# EAGLE design Main (EAGLE 6.2)
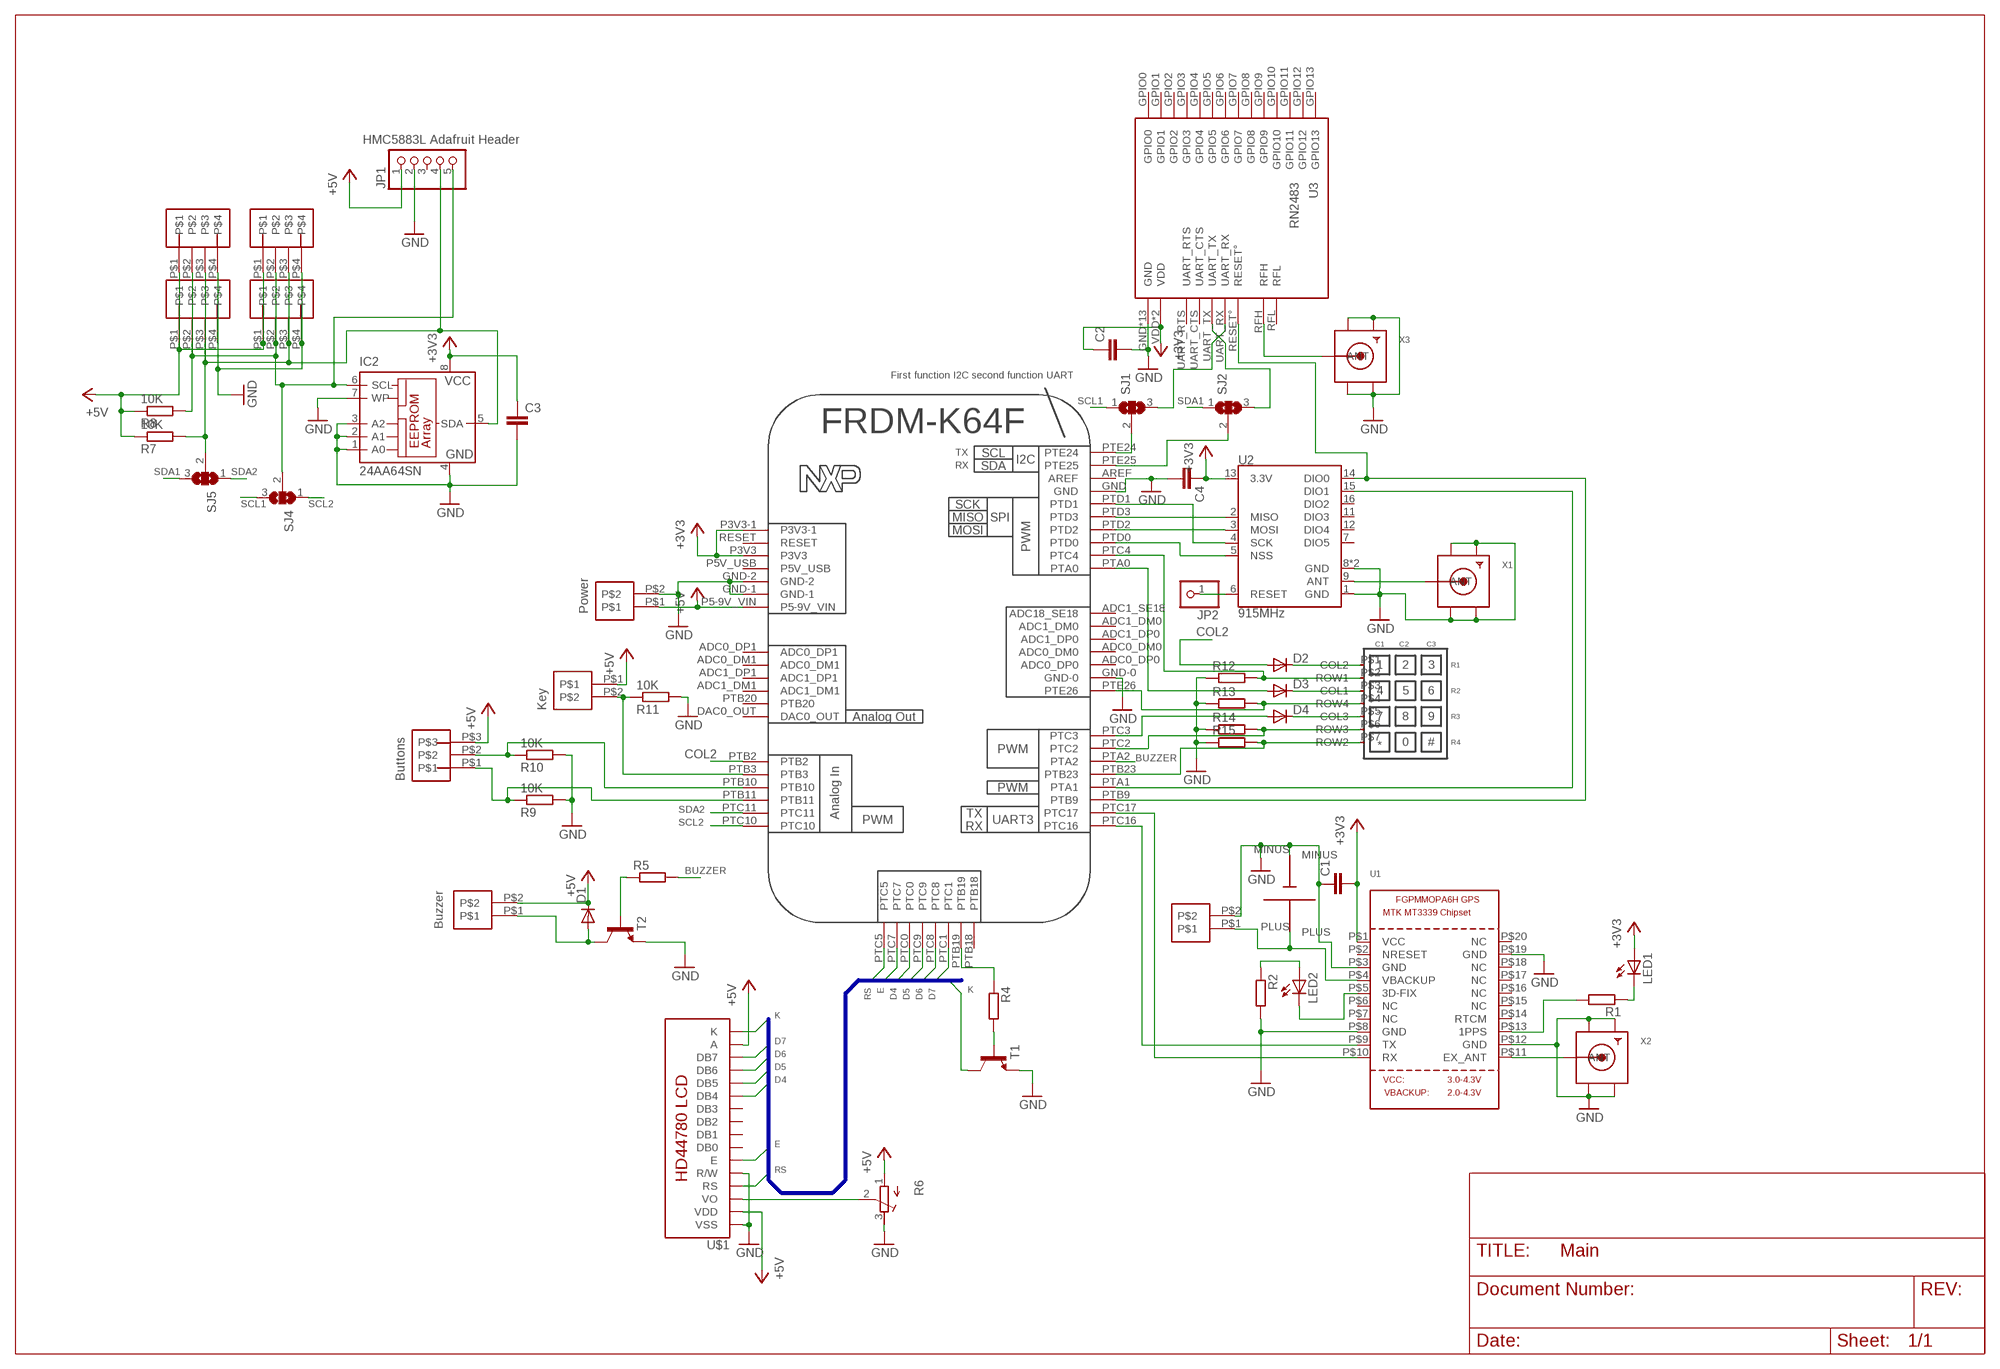
[diagram p0: schematic, sheet 1]

## Parts
C1  C-EUC0603  [C0603]
C2  C-EUC0603  [C0603]
C3  C-EUC0603  [C0603]
C4  C-EUC0603  [C0603]
D1  DIODE-MINIMELF  [MINIMELF]
D2  DIODE-MINIMELF  [MINIMELF]
D3  DIODE-MINIMELF  [MINIMELF]
D4  DIODE-MINIMELF  [MINIMELF]
IC2  24AA64SN  [SO-08]
JP1  PINHD-1X5  [1X05]
JP2  PINHD-1X1  [1X01]
LED1  LEDCHIPLED_1206  [CHIPLED_1206]
LED2  LEDCHIPLED_1206  [CHIPLED_1206]
R1  R-EU_R0603  [R0603]
R2  R-EU_R0603  [R0603]
R4  R-EU_R0603  [R0603]
R5  R-EU_R0603  [R0603]
R6  R-TRIMM3103  [RTRIM3103]
R7  10K  R-EU_R0603  [R0603]
R8  10K  R-EU_R0603  [R0603]
R9  10K  R-EU_R0603  [R0603]
R10  10K  R-EU_R0603  [R0603]
R11  10K  R-EU_R0603  [R0603]
R12  R-EU_R0603  [R0603]
R13  R-EU_R0603  [R0603]
R14  R-EU_R0603  [R0603]
R15  R-EU_R0603  [R0603]
SJ1  SJ2W  [SJ_2]
SJ2  SJ2W  [SJ_2]
SJ4  SJ2W  [SJ_2]
SJ5  SJ2W  [SJ_2]
T1  MMBT3904LT1-NPN-SOT23-BEC  [SOT23-BEC]
T2  MMBT3904LT1-NPN-SOT23-BEC  [SOT23-BEC]
U1  GPS_FGPMMOPA6H  [FGPMMOPA6H]
U2  915MHz  RFM69HCW-915  [RFM69HCW-XXXS2]
U3  RN2483  [RN2483]
U$1  LCD-HD447804-HOLES20X4-4HOLES  [LCD-20X4-4HOLES]
U$2  FRDM  [FRDM]
U$3  4_PIN_JST-XH  [4_PIN_JST-XH]
U$4  2_PIN_JST-XH  [2_PIN_JST-XH]
U$5  4_PIN_JST-XH  [4_PIN_JST-XH]
U$6  3_PIN_JST-XH  [3_PIN_JST-XH]
U$8  2_PIN_JST-XH  [2_PIN_JST-XH]
U$9  2_PIN_JST-XH  [2_PIN_JST-XH]
U$10  KEYPAD  [KEYPAD]
U$11  4_PIN_JST-XH  [4_PIN_JST-XH]
U$12  4_PIN_JST-XH  [4_PIN_JST-XH]
U$13  2_PIN_JST-XH  [2_PIN_JST-XH]
U$14  BATTERY-SMD  [BATTERY-SMD]
X1  SMACONNECTOR_EDGE  [SMA_EDGELAUNCH]
X2  SMACONNECTOR_EDGE  [SMA_EDGELAUNCH]
X3  SMACONNECTOR_EDGE  [SMA_EDGELAUNCH]

## Nets
+3V3: C1.2 C2.1 C3.1 C4.1 IC2.8(VCC) LED1.A U1.P$1(VCC) U2.13(3.3V) U3.VDD U3.VDD2(VDD) U$2.P3V3 U$2.P3V3-1
+5V: D1.C JP1.1 R6.1(E) R7.1 R8.1 U$1.P$2(VDD) U$1.P$15(A) U$2.P5-9V_VIN U$3.P$1 U$4.P$2 U$5.P$1 U$6.P$3 U$8.P$1 U$9.P$1 U$11.P$1 U$12.P$1
BUZZER: R5.2 U$2.PTA2
COL2: D2.A U$2.PTB2
D4: U$1.P$11(DB4) U$2.PTC0
D5: U$1.P$12(DB5) U$2.PTC9
D6: U$1.P$13(DB6) U$2.PTC8
D7: U$1.P$14(DB7) U$2.PTC1
E: U$1.P$6(E) U$2.PTC7
GND: C1.1 C2.2 C3.2 C4.2 IC2.1(A0) IC2.2(A1) IC2.3(A2) IC2.4(GND) IC2.7(WP) JP1.2 R2.2 R6.3(A) R9.2 R10.2 R11.2 R12.1 R13.1 R14.1 R15.1 T1.E T2.E U1.P$3(GND) U1.P$8(GND) U1.P$12(GND) U1.P$19(GND) U2.1(GND) U2.8(GND) U2.10(GND) U3.GND U3.GND1(GND) U3.GND2(GND) U3.GND3(GND) U3.GND4(GND) U3.GND5(GND) U3.GND6(GND) U3.GND7(GND) U3.GND8(GND) U3.GND9(GND) U3.GND10(GND) U3.GND11(GND) U3.GND12(GND) U$1.P$1(VSS) U$1.P$5(R/W) U$2.GND U$2.GND-0 U$2.GND-1 U$2.GND-2 U$3.P$4 U$5.P$4 U$9.P$2 U$11.P$4 U$12.P$4 U$13.P$2 U$14.MINUS X1.GND@1(GND4) X1.GND@2(GND3) X1.GND@3(GND2) X1.GND@4(GND1) X2.GND@1(GND4) X2.GND@2(GND3) X2.GND@3(GND2) X2.GND@4(GND1) X3.GND@1(GND4) X3.GND@2(GND3) X3.GND@3(GND2) X3.GND@4(GND1)
K: T1.C U$1.P$16(K)
N$1: U2.2(MISO) U$2.PTD3
N$2: U2.3(MOSI) U$2.PTD2
N$3: U2.4(SCK) U$2.PTD1
N$4: U2.5(NSS) U$2.PTD0
N$5: U2.9(ANT) X1.P(ANT)
N$6: U1.P$9(TX) U$2.PTC16
N$7: U1.P$11(EX_ANT) X2.P(ANT)
N$8: D4.C U$10.P$5(COL3)
N$9: U1.P$10(RX) U$2.PTC17
N$10: LED1.C R1.1
N$11: LED2.A R2.1
N$12: LED2.C U1.P$5(3D-FIX)
N$13: R1.2 U1.P$13(1PPS)
N$14: SJ1.2 U$2.PTE24
N$15: R11.1 U$2.PTB3 U$8.P$2
N$16: U2.14(DIO0) U3.RESET° U$2.PTB9
N$17: U2.15(DIO1) U$2.PTA1
N$18: D3.C U$10.P$3(COL1)
N$19: R4.1 U$2.PTB19
N$20: R4.2 T1.B
N$21: D1.A T2.C U$4.P$1
N$22: R5.1 T2.B
N$23: D3.A U$2.PTA0
N$24: SJ1.3 U3.UART_RX
N$25: IC2.5(SDA) JP1.4 R7.2 SJ5.2 U$3.P$3 U$5.P$3 U$11.P$3 U$12.P$3
N$26: U1.P$4(VBACKUP) U$13.P$1 U$14.PLUS
N$27: D2.C U$10.P$1(COL2)
N$28: R10.1 U$2.PTB10 U$6.P$2
N$29: R9.1 U$2.PTB11 U$6.P$1
N$30: R15.2 U$2.PTB23 U$10.P$7(ROW2)
N$31: R14.2 U$2.PTC2 U$10.P$6(ROW3)
N$32: R13.2 U$2.PTE26 U$10.P$4(ROW4)
N$33: R12.2 U$2.PTC4 U$10.P$2(ROW1)
N$34: D4.A U$2.PTC3
N$35: JP2.1 U2.6(RESET)
N$36: SJ2.2 U$2.PTE25
N$37: SJ2.3 U3.UART_TX
N$38: IC2.6(SCL) JP1.5 R8.2 SJ4.2 U$3.P$2 U$5.P$2 U$11.P$2 U$12.P$2
N$39: U3.RFH X3.P(ANT)
N$41: R6.2(S) U$1.P$3(VO)
RS: U$1.P$4(RS) U$2.PTC5
SCL1: SJ1.1 SJ4.3
SCL2: SJ4.1 U$2.PTC10
SDA1: SJ2.1 SJ5.3
SDA2: SJ5.1 U$2.PTC11
Unconnected: JP1.3 U1.P$2(NRESET) U1.P$6(NC) U1.P$7(NC) U1.P$14(RTCM) U1.P$15(NC) U1.P$16(NC) U1.P$17(NC) U1.P$18(NC) U1.P$20(NC) U2.7(DIO5) U2.11(DIO3) U2.12(DIO4) U2.16(DIO2) U3.GPIO0 U3.GPIO1 U3.GPIO2 U3.GPIO3 U3.GPIO4 U3.GPIO5 U3.GPIO6 U3.GPIO7 U3.GPIO8 U3.GPIO9 U3.GPIO10 U3.GPIO11 U3.GPIO12 U3.GPIO13 U3.RFL U3.UART_CTS U3.UART_RTS U$1.P$7(DB0) U$1.P$8(DB1) U$1.P$9(DB2) U$1.P$10(DB3) U$2.ADC0_DM0 U$2.ADC0_DM1 U$2.ADC0_DP0 U$2.ADC0_DP1 U$2.ADC1_DM0 U$2.ADC1_DM1 U$2.ADC1_DP0 U$2.ADC1_DP1 U$2.ADC1_SE18(ADC18_SE18) U$2.AREF U$2.DAC0_OUT U$2.P5V_USB U$2.PTB18 U$2.PTB20 U$2.RESET

## Buses
D[4..7],E,RS,VSS,VDD,VO,K,A,RW

## Notes on the sheet
- HMC5883L Adafruit Header
- First function I2C second function UART
- TX
- RX
- Power
- Key
- Buttons
- Buzzer

## Library data of the parts
C1-C4 = rcl:C-EU: CAPACITOR, European symbol
D1-D4 = diode:DIODE-: DIODE
IC2 = microchip:24*: Serial EEPROM I2C; MF: MICROCHIP; MPN: 24AA64-I/SN; OC_FARNELL: 1331304; OC_NEWARK: 85C2288
JP1 = pinhead:PINHD-1X5: PIN HEADER
JP2 = pinhead:PINHD-1X1: PIN HEADER
LED1 LED2 = adafruit:LED: LED OSRAM: - CHIPLED LG R971, LG N971, LY N971, LG Q971, LY Q971, LO R971, LY R971 LH N974, LH R974 LS Q976, LO Q976, LY Q976 LO Q996 - Hyper CHIPLED LW Q18S LB Q993, LB Q99A, LB R99A - SideLED LS A670, LO A670, LY A670, LG A670, LP A670 LB A673, LV A673, LT A673, LW A673 LH A674 LY A675 LS A676, LA A676, LO A676, LY A676, LW A676 LS A679, LY A679, LG A679 - Hyper Micro SIDELED® LS Y876, LA Y876, LO Y876, LY Y876 LT Y87S - SmartLED LW L88C, LW L88S LB L89C, LB L89S, LG L890 LS L89K, LO L89K, LY L89K LS L896, LA L896, LO L896, LY L896 - TOPLED LS T670, LO T670, LY T670, LG T670, LP T670 LSG T670, LSP T670, LSY T670, LOP T670, LYG T670 LG T671, LOG T671, LSG T671 LB T673, LV T673, LT T673, LW T673 LH T674 LS T676, LA T676, LO T676, LY T676, LB T676, LH T676, LSB T676, LW T676 LB T67C, LV T67C, LT T67C, LS T67K, LO T67K, LY T67K, LW E67C LS E67B, LA E67B, LO E67B, LY E67B, LB E67C, LV E67C, LT E67C LW T67C LS T679, LY T679, LG T679 LS T770, LO T770, LY T770, LG T770, LP T770 LB T773, LV T773, LT T773, LW T773 LH T774 LS E675, LA E675, LY E675, LS T675 LS T776, LA T776, LO T776, LY T776, LB T776 LHGB T686 LT T68C, LB T68C - Hyper Mini TOPLED® LB M676 - Mini TOPLED Santana® LG M470 LS M47K, LO M47K, LY M47K Source: http://www.osram.convergy.de/
R1 R2 R4 R5 R7-R15 = rcl:R-EU_: RESISTOR, European symbol
R6 = resistor:R-TRIMM: Trimm resistor
SJ1 SJ2 SJ4 SJ5 = jumper:SJ2W: SMD solder JUMPER
T1 T2 = transistor:*-NPN-: NPN Transistror BF959 corrected 2008.03.06
U1 = adafruit:GPS_FGPMMOPA6H: GPS Module - MTK MT3339 Chipset, -165dBm sensitivity, 22 channels, 10Hz, auto-select external antenna options
U2 = SparkFun-RF:RFM69H: Hope RF RFM69H ISM Transceiver Module The RFM69H is a transceiver module capable of operation over a wide frequency range, including the 315,433,868 and 915MHz license-free ISM (Industry Scientific and Medical) frequency bands. All major RF communication parameters are programmable and most of them can be dynamically set. The RFM69H offers the unique advantage of programmable narrow-band and wide- band communication modes. The RFM69H is optimized for low power consumption while offering high RF output power and channelized operation.Compliance ETSI and FCC regulations. Datasheet <http://www.hoperf.cn/upload/docs/RF/SX/RFM69H_DataSheet_v1.3.pdf> SparkFun Products RFM69HCW Wireless Transceiver - 915MHz <https://www.sparkfun.com/products/13909> (COM-13909) RFM69HCW Wireless Transceiver - 434MHz <https://www.sparkfun.com/products/13910> (COM-13910) SparkFun RFM69 Breakout (915MHz) <https://www.sparkfun.com/products/12775> (WRL-12775) SparkFun RFM69 Breakout (434MHz) <https://www.sparkfun.com/products/12823> (WRL-12823); PROD_ID: IC-11997
U3 = tobias:RN2483: RN2483 Microchip Low-Power Lora Transceiver Module NOT TESTED There are testpads on the bottom of the device. The mask is supposed to cover that, but I have not tested it in practice yet. Info: http://www.microchip.com/wwwproducts/Devices.aspx?product=RN2483 Datasheet: http://ww1.microchip.com/downloads/en/DeviceDoc/50002346B.pdf Adapted from: https://github.com/Octanis1/Octanis1-Electronics/blob/ae493cac28c100e20856abe563dfe8824e9cc4bd/lib/Octanis1.lbr
U$1 = HD44780LCD:LCD-HD44780
U$2 = Projectwerk2:FRDM: This is the symbol and PCB symbol for the FRDM-K64F board. Please not that the PCB symbol is a mirrored plug in type. So tha FRDM board plug in it.
U$3 U$5 U$11 U$12 = JST-XH_HEADERS:4_PIN_JST-XH
U$4 U$8 U$9 U$13 = JST-XH_HEADERS:2_PIN_JST-XH
U$6 = JST-XH_HEADERS:3_PIN_JST-XH
U$10 = adafruit:KEYPAD
U$14 = Projectwerk2:BATTERY-SMD
X1-X3 = adafruit:SMACONNECTOR: SMA Connector 90° DIP SMA Connector, 50 Ohm (4UConnector: 07259)

## Board
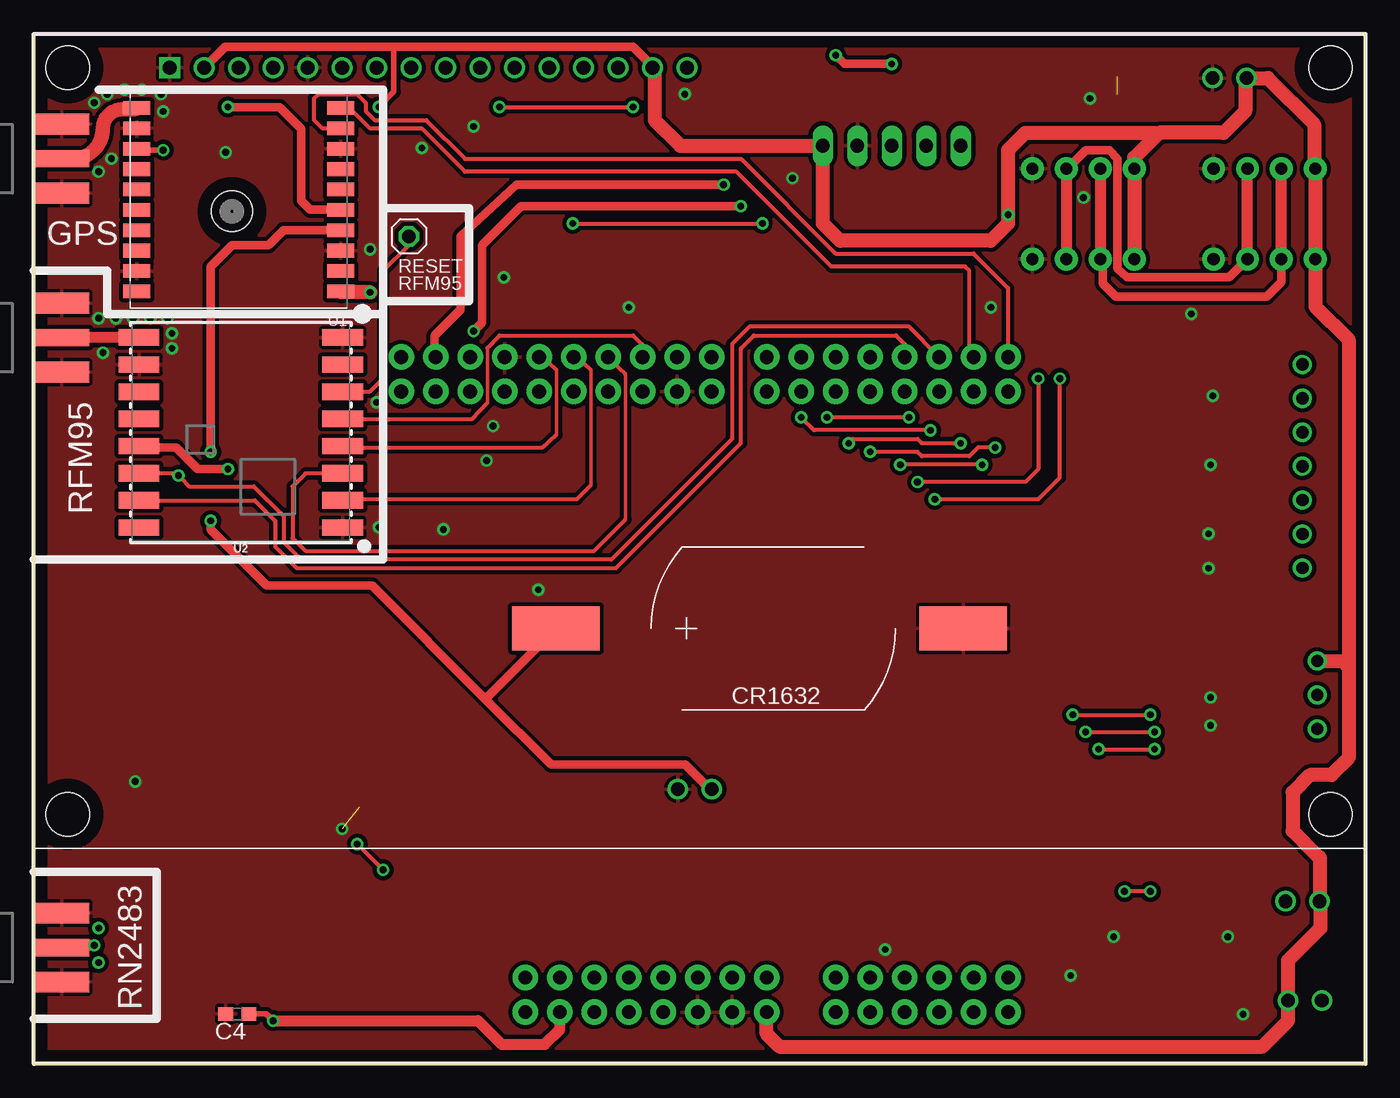
[diagram p1: board, top side]
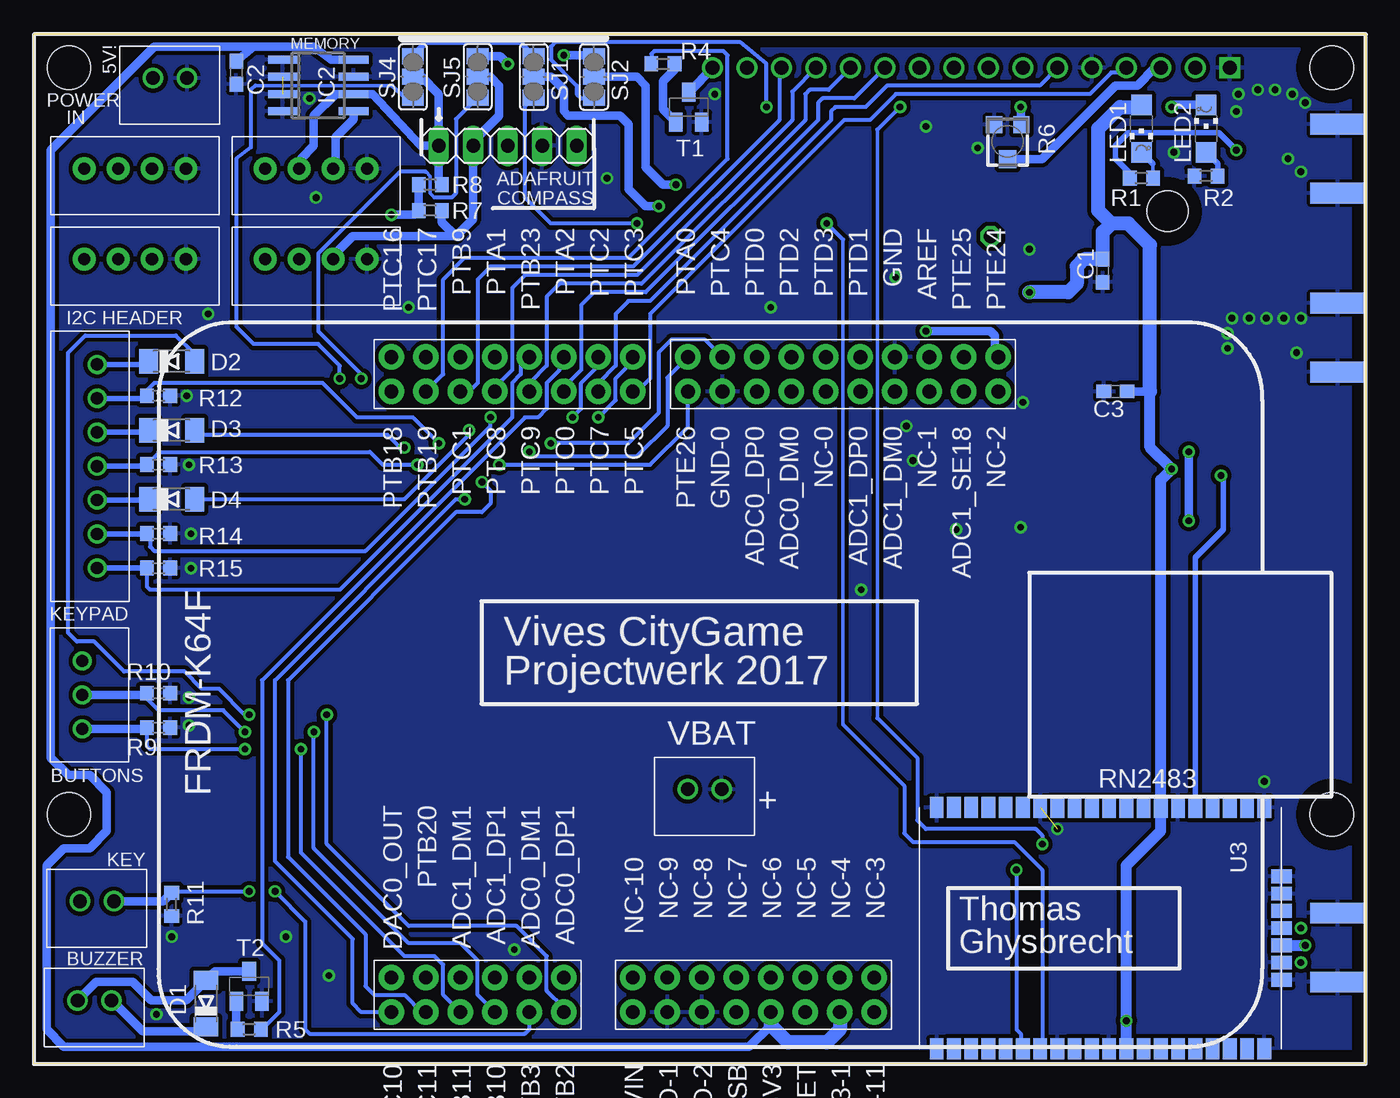
[diagram p2: board, bottom side, seen from below]

Size 98.09 x 75.87 mm. Coordinates in mm from the lower left corner, seen from the top.
Outline: 0,0 98.09,0 98.09,75.87 0,75.87 0,0
Copper layers (1*16): Top 0.035mm / dielectric 1.5mm / Bottom 0.035mm
Design rules: minimum track width 10mil, minimum drill 24mil, track to track 8mil, track to pad 8mil, pad to pad 8mil, via to via 8mil, smd to smd 8mil, copper to edge 40mil, drill to drill 8mil, minimum pad ring 10mil, minimum via ring 8mil, stop-mask expansion 4mil, vias tented up to drill 0mil, thermal gap 10mil

### Footprints (pad centres in the part's own frame; a part is rotated, then mirrored left to right if it is on the bottom)
C0603 = smd 1.1 x 1: 1 -0.85,0; 2 0.85,0
MINIMELF = smd 1.4 x 1.8: A 1.7,0; C -1.7,0
SO-08 = smd 0.6 x 2.2: 1 -1.905,-2.6; 2 -0.635,-2.6; 3 0.635,-2.6; 4 1.905,-2.6; 5 1.905,2.6; 6 0.635,2.6; 7 -0.635,2.6; 8 -1.905,2.6
1X05 = drill 1.016 long: 1 -5.08,0; 2 -2.54,0; 3 0,0; 4 2.54,0; 5 5.08,0
1X01 = drill 1.016 octagon: 1 0,0
CHIPLED_1206 = smd 1.5 x 1.5: A 0,-1.75; C 0,1.75
R0603 = smd 1 x 1.1: 1 -0.85,0; 2 0.85,0
RTRIM3103 = smd 1.2 x 1.25: 1 -1,-1.225; 3 1,-1.225 | smd 1.3 x 1.3: 2 0,1.3
SJ_2 = smd 1.168 x 1.6: 1 -1.524,0; 2 0,0; 3 1.524,0
SOT23-BEC = smd 1 x 1.4: B -0.95,-1.1; C 0,1.1; E 0.95,-1.1
FGPMMOPA6H = smd 2 x 1: P$1 -7.5,6.75; P$2 -7.5,5.25; P$3 -7.5,3.75; P$4 -7.5,2.25; P$5 -7.5,0.75; P$6 -7.5,-0.75; P$7 -7.5,-2.25; P$8 -7.5,-3.75; P$9 -7.5,-5.25; P$10 -7.5,-6.75; P$11 7.5,-6.75; P$12 7.5,-5.25; P$13 7.5,-3.75; P$14 7.5,-2.25; P$15 7.5,-0.75; P$16 7.5,0.75; P$17 7.5,2.25; P$18 7.5,3.75; P$19 7.5,5.25; P$20 7.5,6.75 | hole 3: 0.5,0.85
RFM69HCW-XXXS2 = smd 3 x 1.2: 1 -7.5,7; 2 -7.5,5; 3 -7.5,3; 4 -7.5,1; 5 -7.5,-1; 6 -7.5,-3; 7 -7.5,-5; 8 -7.5,-7; 9 7.5,-7; 10 7.5,-5; 11 7.5,-3; 12 7.5,-1; 13 7.5,1; 14 7.5,3; 15 7.5,5; 16 7.5,7
RN2483 = smd 1.524 x 1.016: GND 17.78,1.27; GND1 17.78,10.16; GND2 17.78,13.97; GND3 17.78,25.4; GND9 0,25.4; GND10 0,19.05; GND11 0,8.89; GND12 0,1.27; GPIO0 0,16.51; GPIO1 0,15.24; GPIO2 0,13.97; GPIO3 0,12.7; GPIO4 0,11.43; GPIO5 0,10.16; GPIO6 0,6.35; GPIO7 0,5.08; GPIO8 0,3.81; GPIO9 0,2.54; GPIO10 17.78,17.78; GPIO11 17.78,16.51; GPIO12 17.78,12.7; GPIO13 17.78,11.43; P$1 0,21.59; P$2 0,22.86; P$3 0,24.13; P$4 17.78,24.13; P$5 17.78,22.86; P$6 17.78,21.59; P$7 17.78,20.32; P$8 17.78,19.05; P$9 17.78,6.35; P$10 17.78,5.08; P$11 0,7.62; RESET° 0,20.32; UART_CTS 17.78,3.81; UART_RTS 17.78,2.54; UART_RX 17.78,8.89; UART_TX 17.78,7.62; VDD 17.78,15.24; VDD2 0,17.78 | smd 1.016 x 1.524: GND4 12.7,26.67; GND5 11.43,26.67; GND6 8.89,26.67; GND7 6.35,26.67; GND8 5.08,26.67; RFH 10.16,26.67; RFL 7.62,26.67
LCD-20X4-4HOLES = drill 1.016 square: P$1 10,57.5 | drill 1.016: P$2 12.54,57.5; P$3 15.08,57.5; P$4 17.62,57.5; P$5 20.16,57.5; P$6 22.7,57.5; P$7 25.24,57.5; P$8 27.78,57.5; P$9 30.32,57.5; P$10 32.86,57.5; P$11 35.4,57.5; P$12 37.94,57.5; P$13 40.48,57.5; P$14 43.02,57.5; P$15 45.56,57.5; P$16 48.1,57.5 | hole 3.2: 2.5,2.5; 2.5,57.5; 95.5,57.5; 95.5,2.5
FRDM = drill 1.016 pad 1.88: ADC0_DM0 -21.59,-2.286; ADC0_DM1 21.59,-21.59; ADC0_DP0 -21.59,-4.826; ADC0_DP1 21.59,-19.05; ADC1_DM0 -21.59,5.334; ADC1_DM1 21.59,-26.67; ADC1_DP0 -21.59,2.794; ADC1_DP1 21.59,-24.13; ADC1_SE18 -21.59,10.414; AREF -24.13,7.874; DAC0_OUT 21.59,-31.75; GND -24.13,5.334; GND-0 -21.59,-7.366; GND-1 24.13,-11.43; GND-2 24.13,-8.89; NC-0 -21.59,0.254; NC-1 -21.59,7.874; NC-2 -21.59,12.954; NC-3 21.59,3.81; NC-4 21.59,1.27; NC-5 21.59,-1.27; NC-6 21.59,-3.81; NC-7 21.59,-6.35; NC-8 21.59,-8.89; NC-9 21.59,-11.43; NC-10 21.59,-13.97; NC-11 24.13,3.81; P3V3 24.13,-3.81; P3V3-1 24.13,1.27; P5-9V_VIN 24.13,-13.97; P5V_USB 24.13,-6.35; PTA0 -24.13,-9.906; PTA1 -24.13,-24.13; PTA2 -24.13,-19.05; PTB2 24.13,-19.05; PTB3 24.13,-21.59; PTB9 -24.13,-26.67; PTB10 24.13,-24.13; PTB11 24.13,-26.67; PTB18 -21.59,-31.75; PTB19 -21.59,-29.21; PTB20 21.59,-29.21; PTB23 -24.13,-21.59; PTC0 -21.59,-19.05; PTC1 -21.59,-26.67; PTC2 -24.13,-16.51; PTC3 -24.13,-13.97; PTC4 -24.13,-7.366; PTC5 -21.59,-13.97; PTC7 -21.59,-16.51; PTC8 -21.59,-24.13; PTC9 -21.59,-21.59; PTC10 24.13,-31.75; PTC11 24.13,-29.21; PTC16 -24.13,-31.75; PTC17 -24.13,-29.21; PTD0 -24.13,-4.826; PTD1 -24.13,2.794; PTD2 -24.13,-2.286; PTD3 -24.13,0.254; PTE24 -24.13,12.954; PTE25 -24.13,10.414; PTE26 -21.59,-9.906; RESET 24.13,-1.27
4_PIN_JST-XH = drill 0.9 pad 1.676: P$1 2.45,3.4; P$2 4.95,3.4; P$3 7.45,3.4; P$4 9.95,3.4
2_PIN_JST-XH = drill 1: P$1 -1.36,0.86; P$2 1.14,0.86
3_PIN_JST-XH = drill 0.9: P$1 2.45,3.4; P$2 4.95,3.4; P$3 7.45,3.4
KEYPAD = drill 0.9: P$1 2.45,3.4; P$2 4.95,3.4; P$3 7.45,3.4; P$4 9.95,3.4; P$5 12.45,3.4; P$6 14.95,3.4; P$7 17.45,3.4
BATTERY-SMD = smd 6.452 x 3.251: MINUS -14,0; PLUS 16,0
SMA_EDGELAUNCH = smd 4.064 x 1.524: GND@1 2.032,-2.54; GND@2 2.032,2.54 | smd 4.064 x 1.524 bottom: GND@3 2.032,2.54; GND@4 2.032,-2.54 | smd 4.064 x 1.27: P 2.032,0

### Placement (x,y rotation side)
C1  19.37,58.42 90 bottom
C2  83.19,73.03 270 bottom
C3  18.41,49.53 180 bottom
C4  14.99,3.68 180 top
D1  85.41,4.45 90 bottom
D2  87.95,51.75 0 bottom
D3  87.95,46.67 0 bottom
D4  87.95,41.59 0 bottom
IC2  77.15,72.07 270 bottom
JP1  63.18,67.63 180 bottom
JP2  27.62,60.96 0 top
LED1  16.51,68.9 180 bottom
LED2  11.75,68.9 0 bottom
R1  16.51,65.25 180 bottom
R2  11.75,65.41 180 bottom
R4  51.75,73.66 0 bottom
R5  82.23,2.54 0 bottom
R6  26.35,67.94 180 bottom
R7  68.9,62.87 0 bottom
R8  68.9,64.77 0 bottom
R9  88.9,24.77 0 bottom
R10  88.9,27.3 0 bottom
R11  87.95,11.75 270 bottom
R12  88.9,49.21 180 bottom
R13  88.9,44.13 180 bottom
R14  88.9,39.05 180 bottom
R15  88.9,36.51 180 bottom
SJ1  61.28,72.71 270 bottom
SJ2  56.83,72.71 270 bottom
SJ4  70.17,72.71 90 bottom
SJ5  65.41,72.71 90 bottom
T1  49.85,70.48 0 bottom
T2  82.23,5.71 0 bottom
U1  15.08,63.66 180 top
U2  15.24,46.51 180 top
U3  32.86,18.89 270 bottom
U$1  0,15.88 0 top
U$2  40.01,27.94 270 bottom
U$3  96.84,55.88 0 bottom
U$4  93.5,3.81 0 bottom
U$5  96.84,62.55 0 bottom
U$6  91.12,22.23 90 bottom
U$8  93.34,11.11 0 bottom
U$9  87.95,71.75 0 bottom
U$10  96.84,53.98 270 bottom
U$11  83.5,62.55 0 bottom
U$12  83.5,55.88 0 bottom
U$13  48.58,19.37 0 bottom
U$14  54.45,32.07 180 top
X1  0,53.5 0 top
X2  0,66.67 0 top
X3  0,8.57 0 top

### Tracks (layer width: path | path; a pad name or v marks a point on that pad's centre or on a via)
+3V3  (via drill 0.5)
  Top 0.406: C4.1 17.11,3.68 v17.62,3.18
  Top 0.61: U2.13 7.85,45.4 10.48,45.4 12.06,43.81 v14.29,43.81
  Top 0.813: v17.62,3.18 32.7,3.18 34.45,1.43 37.62,1.43 38.73,2.54 U$2.P3V3-1
  Top 1.016: v24.77,56.83 22.66,56.83 U1.P$1
  Bottom 0.406: 17.43,12.89 17.62,12.7
  Bottom 0.61: IC2.8 76.2,73.98 77.47,74.93 81.92,74.93 | 81.92,74.93 89.22,74.93 96.84,67.31 96.84,22.54 95.57,21.27 93.98,21.27 92.71,20 92.71,17.14 93.98,15.88 95.89,15.88 97.16,14.61 97.16,2.54 95.89,1.27 45.4,1.27 43.81,2.86 | C2.1 81.92,74.93 | C3.1 15.88,49.53
  Bottom 0.813: U3.VDD v17.62,3.18 17.62,12.7 17.62,14.61 15.08,17.14 U3.VDD2 15.08,43.02 v14.29,43.81 15.88,45.4 15.88,49.53
  Bottom 1.016: U$2.P3V3 43.81,2.86 42.55,1.59 39.69,1.59 38.73,2.54 U$2.P3V3-1 | 15.88,49.53 15.88,60.33 17.46,61.91 18.73,61.91 | 18.73,61.91 19.68,62.87 19.68,68.9 18.1,70.48 16.67,70.48 LED1.A | 18.73,61.91 19.37,61.28 C1.2 20.74,59.27 21.27,58.74 21.27,57.47 21.91,56.83 v24.77,56.83
+5V  (via drill 0.5)
  Top 0.406: v25.4,70.48 26.51,71.6 26.51,74.93
  Top 0.61: U$1.P$2 14.1,74.93 26.51,74.93 44.13,74.93 45.56,73.5
  Top 1.016: 96.84,29.21 96.84,53.34 94.39,55.79 U$3.P$1 U$5.P$1 94.3,66.04 94.3,69.22 90.9,72.62 U$9.P$1 89.22,72.62 89.22,70.17 87.63,68.58 82.87,68.58 82.71,68.42 | 96.84,29.21 96.84,22.54 95.57,21.27 93.98,21.27 92.71,20 92.71,17.14 94.61,15.24 94.7,15.24 U$8.P$1 94.77,11.9 94.77,10 92.39,7.62 92.39,4.64 | U$2.P5-9V_VIN 53.98,2.22 54.93,1.27 90.49,1.27 92.39,3.18 92.39,4.64 | U$6.P$3 96.37,29.68 96.84,29.21 | 82.71,68.42 81.05,66.77 U$11.P$1 U$12.P$1 | 45.56,73.5 U$1.P$15 45.72,73.22 45.72,69.53 47.62,67.63 JP1.1 58.1,61.91 59.37,60.64 70.48,60.64 71.75,61.91 v71.75,62.55 71.75,67.31 73.03,68.58 82.55,68.58 82.71,68.42 | 92.39,4.64 U$4.P$2
  Bottom 0.61: R6.1 25.4,69.22 v25.4,70.48 | R8.1 R7.1 70.06,62.55 v71.75,62.55 | D1.C 85.77,2.38 90.08,2.38 U$4.P$2
BUZZER
  Bottom 0.305: U$2.PTA2 59.37,51.75 59.37,51.12 60.33,50.16 60.33,48.26 60.96,47.62 61.91,47.62 81.28,28.26 81.28,8.89 80.01,7.62 80.01,3.81 81.28,2.54 R5.2
COL2  (via drill 0.5)
  Top 0.305: v76.52,25.72 v82.23,25.72
  Bottom 0.305: U$2.PTB2 59.05,4.13 60.33,5.4 60.33,7.94 62.55,10.16 70.48,10.16 76.52,16.19 v76.52,25.72 | v82.23,25.72 82.55,25.72 84.45,27.62 85.72,27.62 87,28.89 91.44,28.89 93.66,31.12 94.93,31.12 95.57,31.75 95.57,52.39 94.3,53.66 87.63,53.66 86.36,52.39 86.36,51.44 86.04,51.12 86.04,51.55 D2.A
D4
  Bottom 0.305: U$1.P$11 37.66,71.12 40.01,71.12 40.32,70.8 40.32,69.53 53.02,56.83 56.83,56.83 57.78,55.88 57.78,51.12 59.05,49.85 U$2.PTC0
D5
  Bottom 0.305: U$1.P$12 39.56,71.75 40.96,71.75 41.27,71.44 41.27,69.53 53.34,57.47 59.37,57.47 60.33,56.52 60.33,51.44 61.59,50.16 U$2.PTC9
D6
  Bottom 0.305: U$1.P$13 42.23,71.63 42.23,69.53 53.66,58.1 61.91,58.1 62.87,57.15 62.87,51.12 64.14,49.85 U$2.PTC8
D7
  Bottom 0.305: U$1.P$14 43.18,73.22 43.18,69.53 53.98,58.74 64.45,58.74 65.41,57.78 65.41,50.16 66.04,49.53 U$2.PTC1
E
  Bottom 0.305: U$1.P$6 24,72.07 35.24,72.07 36.83,70.48 39.05,70.48 39.37,70.17 39.37,69.53 52.7,56.2 54.29,56.2 55.24,55.24 55.24,51.44 56.52,50.16 U$2.PTC7
GND  (via drill 0.5)  (2 unrouted)
  Top 1.016: U$1.P$1 9.84,73.22
  other vias: 47.94,71.44 5.71,66.67 4.76,65.72 4.45,70.8 5.4,71.44 6.67,71.75 7.94,71.75 4.76,54.93 6.03,54.93 7.3,54.93 5.08,52.39 14.13,67.15 24.77,60.01 25.24,48.74 33.81,46.99 30.16,39.37 25.4,39.53 86.68,24.92 86.68,26.99 87.95,9.37 86.52,36.51 86.52,39.05 86.68,44.13 86.84,49.21 77.79,71.12 28.57,67.47 9.53,70.17 9.37,71.44 8.57,54.93 9.84,54.93 10.16,53.82 10.16,52.7 22.7,17.3 89.06,3.65 7.46,20.8 77.31,63.82 85.25,55.24 34.61,57.94 43.81,55.72 37.15,34.92 33.34,44.45 32.38,69.06 55.88,65.25 70.48,55.72 79.53,9.37 76.36,6.51 62.71,8.41
  pour Top (isolate 0.305): 0,75.88 98.11,75.88 98.11,0 0,0
  pour Bottom (isolate 0.305): 0,75.88 98.11,75.88 98.11,0 0,0
K
  Bottom 0.61: U$1.P$16 48.06,73.38 T1.C
N$1
  Top 0.254: 41.03,42.65 41.03,51.12
  Top 0.305: U2.2 22.82,41.59 40.01,41.59 41.03,42.65 | 41.03,51.12 40.01,52.07 U$2.PTD3
N$2
  Top 0.254: 43.57,40.11 43.57,50.8
  Top 0.305: U2.3 22.72,43.5 20,43.5 19.05,42.55 19.05,38.73 20,37.78 41.27,37.78 43.57,40.11 | 43.57,50.8 42.29,52.01 U$2.PTD2
N$3
  Top 0.254: 38.49,46.35 38.49,51.12
  Top 0.305: U2.4 22.85,45.4 37.47,45.4 38.49,46.35 | 38.49,51.12 37.47,52.07 U$2.PTD1
N$4
  Top 0.254: 33.41,48.7 33.41,52.74
  Top 0.305: U2.5 32.27,47.51 33.41,48.7 | 33.41,52.74 34.29,53.66 44.13,53.66 44.77,53.02 44.77,52.13 U$2.PTD0
N$5
  Top 0.813: U2.9 2.71,53.51 arc90 2.54,53.34 2.19,53.34 arc-90 X1.P
N$6
  Top 0.305: U1.P$9 21.27,68.9 20.64,69.53 20.64,71.12 20.95,71.44 23.81,71.44 24.45,70.8 24.45,70.17 25.08,69.53 28.89,69.53 31.75,66.67 52.07,66.67 59.05,59.69 69.22,59.69 71.75,57.15 U$2.PTC16
N$7
  Top 1.016: X2.P 2.86,66.67 arc90 5.08,68.9 arc-90 6.51,70.33 7.5,70.33 arc90 U1.P$11
N$8
  Bottom 0.406: 89.72,41.52 U$10.P$5
  Bottom 0.61: D4.C 89.72,41.52
N$9
  Top 0.305: U$2.PTC17 68.9,52.39 68.9,58.42 68.58,58.74 58.74,58.74 51.75,65.72 31.75,65.72 28.57,68.9 24.77,68.9 23.25,70.41 U1.P$10
N$10
  Bottom 0.254: R1.1 15.66,66.3
  Bottom 0.406: 15.66,66.3 LED1.C
N$11
  Bottom 0.406: R2.1 10.9,66.3 LED2.A
N$12  (via drill 0.5)
  Top 0.61: v14.29,70.48 18.1,70.48 19.68,68.9 19.68,63.58 20.36,62.91 U1.P$5
  Bottom 0.61: v14.29,70.48 14.12,70.65 LED2.C
N$13  (via drill 0.5)
  Top 0.406: v9.53,67.31 7.68,67.31 U1.P$13
  Bottom 0.406: R1.2 17.36,65.62 18.41,66.67 18.41,67.63 17.46,68.58 10.79,68.58 v9.53,67.31
N$14  (via drill 0.5)
  Top 0.61: v52.07,63.18 35.88,63.18 33.02,60.33 33.02,54.61 v32.38,53.98
  Bottom 0.61: SJ1.2 60.01,72.71 59.05,71.75 59.05,70.17 58.74,69.85 54.93,69.85 54.29,69.22 54.29,64.45 53.02,63.18 v52.07,63.18 | v32.38,53.98 27.62,53.98 27.3,53.66 27.3,52.32 U$2.PTE24
N$15  (via drill 0.5)
  Top 0.305: v82.23,12.7 v80.33,12.7
  Bottom 0.305: R11.1 87.84,12.7 v82.23,12.7 | v80.33,12.7 78.11,10.48 78.11,2.54 77.79,2.22 61.91,2.22 61.59,2.54 U$2.PTB3
  Bottom 0.61: R11.1 88.57,11.97 U$8.P$2
N$16  (via drill 0.5)
  Top 0.305: U$2.PTB9 64.45,54.29 52.7,54.29 51.44,53.02 51.44,46.04 42.55,37.15 19.68,37.15 18.41,38.42 18.41,40.32 16.19,42.55 11.43,42.55 10.79,43.18 | U2.14 10.46,43.51 v10.64,43.34
  Top 0.406: v10.64,43.34 10.79,43.18
  Bottom 0.406: U3.RESET° 12.54,37.31 10.48,39.37 10.48,43.18 v10.64,43.34
N$17
  Top 0.305: U2.15 16.27,41.51 17.78,40 17.78,38.1 19.37,36.51 42.86,36.51 52.07,45.72 52.07,52.7 53.02,53.66 63.5,53.66 64.14,53.02 U$2.PTA1
N$18
  Bottom 0.406: 89.8,46.52 U$10.P$3
  Bottom 0.61: D3.C 89.8,46.52
N$19
  Bottom 0.305: U$2.PTB19 67.94,50.8 67.94,57.78 66.36,59.37 54.29,59.37 46.99,66.67 46.99,74.3 47.31,74.61 52.39,74.61 52.6,74.4 R4.1
N$20
  Bottom 0.61: R4.2 50.9,73.24 51.75,72.39 51.75,70.34 T1.B
N$21
  Bottom 0.61: T2.C 84.74,6.81 D1.A 86.88,4.67 89.44,4.67 90.81,6.03 93.5,6.03 U$4.P$1
N$22
  Bottom 0.61: R5.1 83.18,2.64 T2.B
N$23  (via drill 0.5)
  Top 0.305: v70.8,45.4 69.53,45.4 68.9,44.77 65.41,44.77 65.09,45.09 v61.59,45.09
  Bottom 0.305: D3.A 85.93,46.36 72.07,46.36 71.12,45.4 v70.8,45.4 | v61.59,45.09 61.28,44.77 53.66,44.77 51.44,46.99 51.44,50.55 U$2.PTA0
N$24  (via drill 0.5)
  Top 0.305: v39.69,61.91 v53.66,61.91
  Bottom 0.254: 38.49,60.72 38.49,25
  Bottom 0.305: 38.49,60.72 v39.69,61.91 | v53.66,61.91 60.01,61.91 61.91,63.82 61.91,70.55 SJ1.3 | U3.UART_RX 23.81,1.27 23.81,14.29 25.88,16.35 33.34,16.35 33.97,16.99 33.97,20.48 38.49,25
N$25
  Top 0.61: U$11.P$3 76.11,65.95 77.47,67.31 79.22,67.31 79.8,66.67 79.8,58.58 80.49,57.94 88.05,57.94 U$3.P$3
  Top 0.813: U$11.P$3 U$12.P$3 | U$3.P$3 U$5.P$3
  Bottom 0.61: 75.88,66.12 75.88,68.26 74.55,69.59 IC2.5 | 75.88,66.12 U$11.P$3 | 75.88,66.12 75.88,65.72 | 66.99,60.96 74.61,60.96 76.05,59.52 U$12.P$3 | 66.99,60.96 65.72,62.23 JP1.4 65.72,67.94 63.82,69.85 63.82,72.07 64.45,72.71 SJ5.2 | 66.99,60.96 68.05,62.02 R7.2
N$26  (via drill 0.5)
  Top 0.61: 33.24,26.89 24.9,35.24 17.14,35.24 13.02,39.37 v13.02,40 | v13.02,45.09 13.02,58.74 14.61,60.33 17.3,60.33 18.39,61.41 U1.P$4 | U$14.PLUS 33.28,26.89 33.24,26.89 | 33.24,26.89 38.07,22.07 47.94,22.07 49.78,20.23 U$13.P$1
  Bottom 0.61: v13.02,40 v13.02,45.09
N$27
  Bottom 0.406: 89.88,51.52 U$10.P$1
  Bottom 0.61: D2.C 89.88,51.52
N$28  (via drill 0.5)
  Top 0.305: v77.47,24.45 v82.55,24.45
  Bottom 0.305: U$2.PTB10 65.41,5.08 65.41,7.62 66.67,8.89 70.48,8.89 77.47,15.88 v77.47,24.45 | v82.55,24.45 84.14,26.04 88.9,26.04 89.75,26.88 R10.1
  Bottom 0.61: R10.1 89.88,27.18 U$6.P$2
N$29  (via drill 0.5)
  Top 0.305: v78.42,23.18 v82.55,23.18
  Bottom 0.305: U$2.PTB11 67.94,5.08 67.94,7.3 68.58,7.94 70.8,7.94 78.42,15.56 v78.42,23.18 | v82.55,23.18 89.53,23.18 89.75,23.39 R9.1
  Bottom 0.61: R9.1 89.84,24.68 U$6.P$1
N$30
  Bottom 0.305: U$2.PTB23 62.23,51.44 62.23,50.8 62.87,50.16 62.87,47.62 75.56,34.92 89.53,34.92 89.75,35.14 R15.2
  Bottom 0.406: 89.76,36.52 U$10.P$7
  Bottom 0.61: R15.2 89.76,36.52
N$31  (via drill 0.5)
  Top 0.305: v64.45,47.62 v58.42,47.62
  Bottom 0.305: R14.2 89.53,38.84 89.53,38.1 89.22,37.78 73.66,37.78 64.45,46.99 v64.45,47.62 | v58.42,47.62 57.78,48.26 57.78,50.16 56.52,51.44 U$2.PTC2
  Bottom 0.406: 89.78,39.02 U$10.P$6
  Bottom 0.61: R14.2 89.78,39.02
N$32  (via drill 0.5)
  Top 0.305: v69.85,44.13 v63.82,44.13
  Bottom 0.305: R13.2 88.9,44.98 88.9,45.09 73.34,45.09 72.39,44.13 v69.85,44.13 | v63.82,44.13 52.7,44.13 49.91,46.93 U$2.PTE26
  Bottom 0.406: 89.86,44.02 U$10.P$4
  Bottom 0.61: R13.2 89.86,44.02
N$33  (via drill 0.5)
  Top 0.305: v60.01,45.72 60.33,46.04 65.09,46.04 65.41,45.72 v68.26,45.72
  Bottom 0.305: U$2.PTC4 48.64,53.34 51.12,53.34 52.07,52.39 52.07,47.94 54.29,45.72 v60.01,45.72 | v68.26,45.72 70.17,47.62 74.3,47.62 76.83,50.16 89.22,50.16 89.75,49.63 R12.2
  Bottom 0.406: 89.94,49.02 U$10.P$2
  Bottom 0.61: R12.2 89.94,49.02
N$34  (via drill 0.5)
  Top 0.305: v66.04,46.67 57.47,46.67 v56.52,47.62
  Bottom 0.305: D4.A 70.8,41.59 66.04,46.36 v66.04,46.67 | v56.52,47.62 55.24,48.9 55.24,50.48 53.98,51.75 U$2.PTC3
N$35
  Top 0.305: U2.6 22.76,49.53 24.77,49.53 25.72,50.48 25.72,58.42 27.62,60.33 JP2.1
N$36  (via drill 0.5)
  Top 0.61: v50.8,64.77 35.56,64.77 31.43,60.96 31.43,55.56 29.53,53.66 29.53,52.13 U$2.PTE25
  Bottom 0.61: SJ2.2 53.66,72.71 53.02,72.07 53.02,66.04 51.75,64.77 v50.8,64.77
N$37  (via drill 0.5)
  Top 0.305: v34.29,70.48 v44.13,70.48 | v23.81,16.19 v25.72,14.29
  Bottom 0.254: 35.96,68.82 35.96,25.48
  Bottom 0.305: 35.96,68.82 v34.29,70.48 | v44.13,70.48 44.13,73.66 46.04,75.25 59.69,75.25 60.01,74.93 60.01,73.98 58.1,72.07 58.1,71.44 57.78,71.12 56.9,71.12 SJ2.3 | v23.81,16.19 23.81,16.83 24.29,17.3 32.38,17.3 33.02,17.94 33.02,22.54 35.96,25.48 | v25.72,14.29 25.72,2.54 25.4,2.22 25.4,1.27 U3.UART_TX
N$38
  Top 0.61: U$5.P$2 91.89,57.6 90.81,56.52 79.69,56.52 78.74,57.47 78.74,59.09 U$12.P$2
  Top 0.813: U$11.P$2 U$12.P$2 | U$3.P$2 U$5.P$2
  Bottom 0.61: U$11.P$2 78.42,66.08 78.42,66.67 77.47,67.63 77.47,69.85 75.88,71.44 IC2.6 73.15,71.44 69.6,67.63 JP1.5 | SJ4.2 69.53,72.71 68.26,71.44 JP1.5 | R8.2 68.26,64.98 JP1.5
N$39  (via drill 0.5)
  Top 0.813: v4.45,8.73 2.19,8.73 X3.P
  Bottom 0.813: U3.RFH v4.45,8.73
N$41
  Bottom 0.61: U$1.P$3 15.53,73.38 16.83,72.07 18.41,72.07 23.84,66.65 R6.2
N$44  (via drill 0.5)
  other vias: 4.76,10
N$45  (via drill 0.5)
  other vias: 4.76,7.46
RS
  Bottom 0.305: U$1.P$4 17.97,73.03 18.73,73.03 20.32,71.44 34.61,71.44 36.51,69.53 38.42,69.53 52.7,55.24 52.7,50.48 53.66,49.53 U$2.PTC5
SCL1
  Bottom 0.406: 70.17,74.3 69.22,75.25 62.29,75.25 SJ1.1
  Bottom 0.61: SJ4.3 70.17,74.3
SCL2  (via drill 0.5)
  Top 0.305: v66.36,41.59 73.98,41.59 75.56,43.18 v75.56,50.48
  Bottom 0.254: 71.69,72.07 81.79,72.07
  Bottom 0.305: U$2.PTC10 73.98,3.81 74.61,4.45 74.61,9.21 80.33,14.92 80.33,28.26 66.99,41.59 v66.36,41.59 | v75.56,50.48 75.56,51.44 77.15,53.02 81.92,53.02 83.19,54.29 83.19,66.67 82.11,67.5 82.11,71.75 81.79,72.07 | 71.69,72.07 70.8,71.18 SJ4.1
SDA1  (via drill 0.5)
  Top 0.61: v63.18,73.66 59.69,73.66 v59.05,74.3
  Bottom 0.61: SJ5.3 63.75,74.23 v63.18,73.66 | v59.05,74.3 56.9,74.3 SJ2.1
SDA2  (via drill 0.5)
  Top 0.305: v73.98,50.48 73.98,43.81 73.03,42.86 v65.09,42.86
  Bottom 0.254: 68.58,63.82 68.9,64.13 68.9,65.41 69.22,65.72
  Bottom 0.305: SJ5.1 66.99,69.6 66.99,64.13 67.31,63.82 68.58,63.82 | 69.22,65.72 71.12,65.72 77.15,59.69 77.15,53.98 73.98,50.8 v73.98,50.48 | v65.09,42.86 64.45,42.23 64.45,41.27 65.09,40.64 66.99,40.64 79.38,28.26 79.38,15.24 73.66,9.53 73.66,5.71 73.03,5.08 70.8,5.08 69.53,3.81 U$2.PTC11

### Text on the board
bPlace: 5V! | POWER | IN | ADAFRUIT | COMPASS | I2C HEADER | KEYPAD | Vives CityGame | Projectwerk 2017 | BUTTONS | KEY | BUZZER
tNames: GPS | RESET | RFM95 | RFM95 | RN2483
bNames: MEMORY | VBAT | RN2483 | + | Thomas | Ghysbrecht
bValues: RN2483